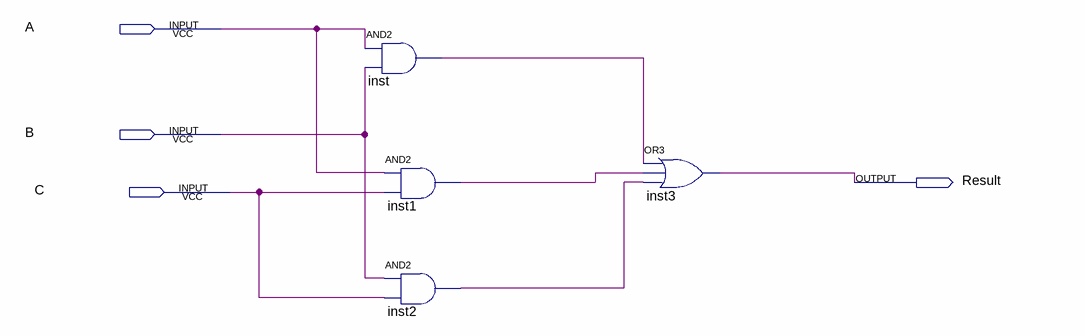
[diagram p0: schematic sheet]
// Quartus schematic voter.bdf as structural Verilog: 4 symbols, 4 pins
module voter (
  input  A,
  input  B,
  input  C,
  output Result
);

  wire inst1_out, inst2_out, inst_out;

  and inst (inst_out, A, B);
  and inst1 (inst1_out, A, C);
  and inst2 (inst2_out, B, C);
  or inst3 (Result, inst_out, inst1_out, inst2_out);
endmodule
